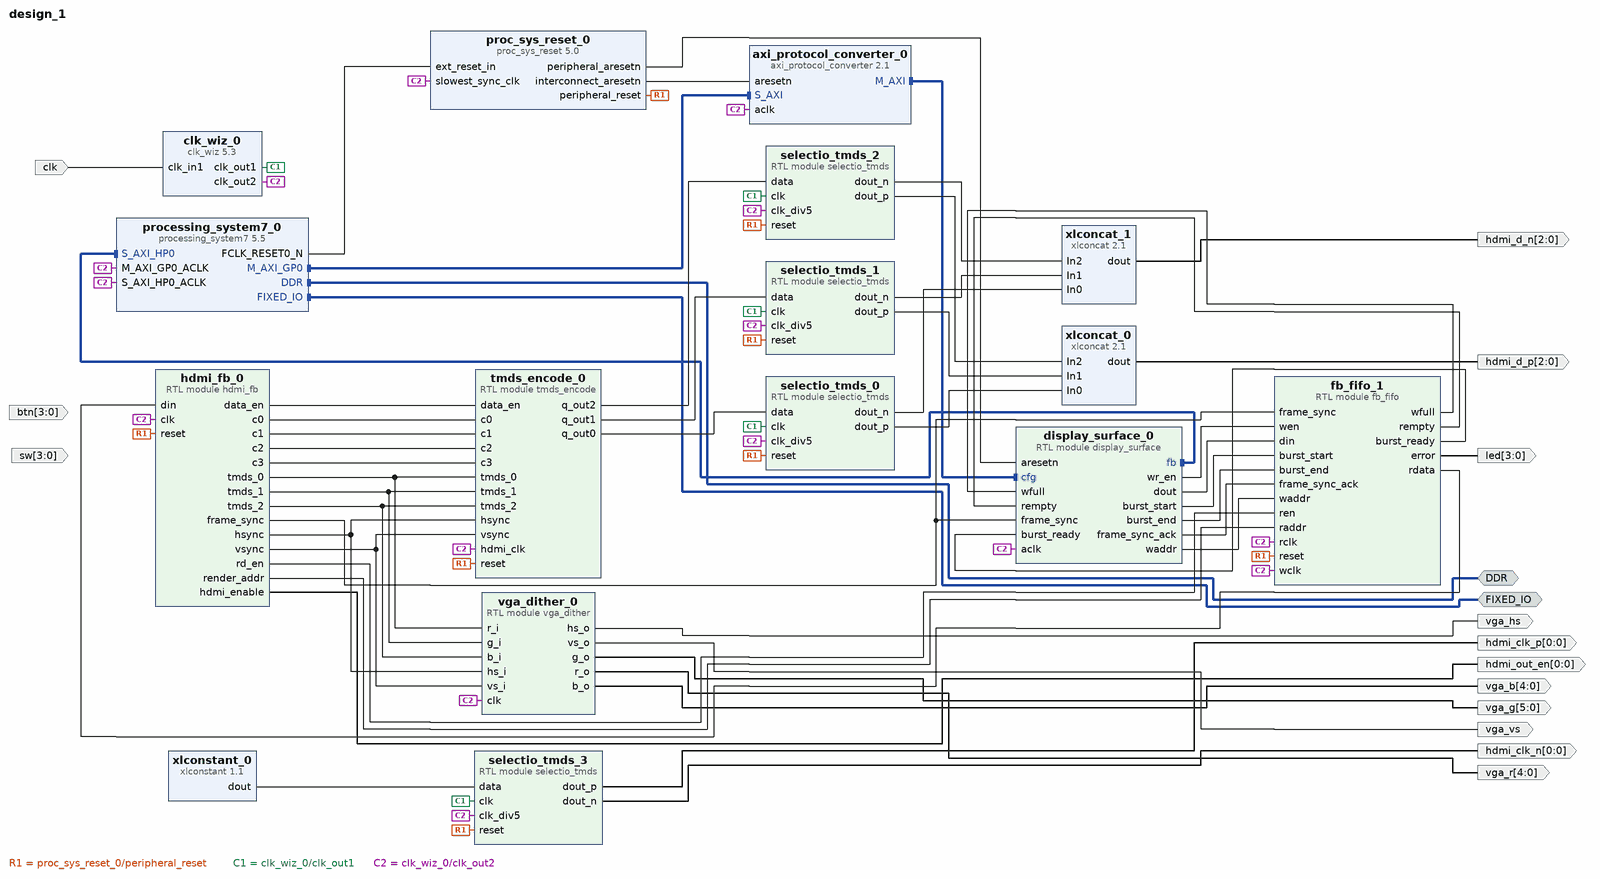
[diagram p0: block diagram of the top level]
# Vivado block design design_1, Vivado 2016.2
create_bd_design design_1

create_bd_intf_port -mode Master -vlnv xilinx.com:interface:ddrx_rtl:1.0 DDR
create_bd_intf_port -mode Master -vlnv xilinx.com:display_processing_system7:fixedio_rtl:1.0 FIXED_IO
create_bd_port -dir I -from 3 -to 0 -type data btn
create_bd_port -dir I -from 3 -to 0 -type data sw
create_bd_port -dir O -from 0 -to 0 -type data hdmi_out_en
create_bd_port -dir O -from 2 -to 0 -type data hdmi_d_p
create_bd_port -dir O -from 2 -to 0 -type data hdmi_d_n
create_bd_port -dir O -from 0 -to 0 -type clk hdmi_clk_p
create_bd_port -dir O -from 0 -to 0 -type clk hdmi_clk_n
create_bd_port -dir O vga_hs
create_bd_port -dir O vga_vs
create_bd_port -dir O -from 4 -to 0 -type data vga_r
create_bd_port -dir O -from 5 -to 0 -type data vga_g
create_bd_port -dir O -from 4 -to 0 -type data vga_b
create_bd_port -dir O -from 3 -to 0 led
create_bd_port -dir I -type clk clk
set_property -dict {CONFIG.FREQ_HZ 125000000} [get_bd_ports clk]

create_bd_cell -type ip -vlnv xilinx.com:ip:processing_system7:5.5 processing_system7_0
set_property -dict [list \
  CONFIG.PCW_UIPARAM_DDR_FREQ_MHZ 525 \
  CONFIG.PCW_CRYSTAL_PERIPHERAL_FREQMHZ 50.000000 \
  CONFIG.PCW_APU_PERIPHERAL_FREQMHZ 650 \
  CONFIG.PCW_SDIO_PERIPHERAL_FREQMHZ 50 \
  CONFIG.PCW_FPGA0_PERIPHERAL_FREQMHZ 100 \
  CONFIG.PCW_USE_S_AXI_HP0 1 \
  CONFIG.PCW_USE_FABRIC_INTERRUPT 1 \
  CONFIG.PCW_IRQ_F2P_INTR 1 \
  CONFIG.PCW_PRESET_BANK1_VOLTAGE {LVCMOS 1.8V} \
  CONFIG.PCW_UIPARAM_DDR_PARTNO {MT41K128M16 JT-125} \
  CONFIG.PCW_QSPI_PERIPHERAL_ENABLE 1 \
  CONFIG.PCW_QSPI_GRP_SINGLE_SS_ENABLE 1 \
  CONFIG.PCW_QSPI_GRP_FBCLK_ENABLE 1 \
  CONFIG.PCW_ENET0_PERIPHERAL_ENABLE 1 \
  CONFIG.PCW_ENET0_ENET0_IO {MIO 16 .. 27} \
  CONFIG.PCW_ENET0_GRP_MDIO_ENABLE 1 \
  CONFIG.PCW_ENET0_RESET_ENABLE 0 \
  CONFIG.PCW_SD0_PERIPHERAL_ENABLE 1 \
  CONFIG.PCW_SD0_GRP_CD_ENABLE 1 \
  CONFIG.PCW_SD0_GRP_CD_IO {MIO 47} \
  CONFIG.PCW_SD0_GRP_WP_ENABLE 1 \
  CONFIG.PCW_UART1_PERIPHERAL_ENABLE 1 \
  CONFIG.PCW_TTC0_PERIPHERAL_ENABLE 1 \
  CONFIG.PCW_USB0_PERIPHERAL_ENABLE 1 \
  CONFIG.PCW_USB0_RESET_ENABLE 1 \
  CONFIG.PCW_USB0_RESET_IO {MIO 46} \
  CONFIG.PCW_GPIO_MIO_GPIO_ENABLE 1 \
] [get_bd_cells processing_system7_0]
# 106 more settings of processing_system7_0 are not shown: defaults, MIO pin electricals, DDR timing, and values the tool derives
create_bd_cell -type ip -vlnv xilinx.com:ip:proc_sys_reset:5.0 proc_sys_reset_0
create_bd_cell -type ip -vlnv xilinx.com:ip:xlconcat:2.1 xlconcat_0
set_property -dict {CONFIG.NUM_PORTS 3} [get_bd_cells xlconcat_0]
create_bd_cell -type ip -vlnv xilinx.com:ip:xlconcat:2.1 xlconcat_1
set_property -dict {CONFIG.NUM_PORTS 3} [get_bd_cells xlconcat_1]
create_bd_cell -type ip -vlnv xilinx.com:ip:xlconstant:1.1 xlconstant_0
set_property -dict {CONFIG.CONST_WIDTH 10 CONFIG.CONST_VAL 992} [get_bd_cells xlconstant_0]
create_bd_cell -type module -reference selectio_tmds selectio_tmds_0
create_bd_cell -type ip -vlnv xilinx.com:ip:axi_protocol_converter:2.1 axi_protocol_converter_0
create_bd_cell -type module -reference tmds_encode tmds_encode_0
create_bd_cell -type module -reference vga_dither vga_dither_0
create_bd_cell -type module -reference display_surface display_surface_0
create_bd_cell -type module -reference fb_fifo fb_fifo_1
create_bd_cell -type ip -vlnv xilinx.com:ip:clk_wiz:5.3 clk_wiz_0
set_property -dict [list \
  CONFIG.CLKOUT2_USED true \
  CONFIG.NUM_OUT_CLKS 2 \
  CONFIG.CLKOUT1_REQUESTED_OUT_FREQ 125 \
  CONFIG.CLKOUT2_REQUESTED_OUT_FREQ 25 \
  CONFIG.USE_LOCKED false \
  CONFIG.USE_RESET false \
  CONFIG.MMCM_DIVCLK_DIVIDE 1 \
  CONFIG.MMCM_CLKOUT0_DIVIDE_F 8.000 \
  CONFIG.MMCM_CLKOUT1_DIVIDE 40 \
  CONFIG.CLKOUT1_JITTER 119.348 \
  CONFIG.CLKOUT2_JITTER 165.419 \
  CONFIG.CLKOUT2_PHASE_ERROR 96.948 \
] [get_bd_cells clk_wiz_0]
create_bd_cell -type module -reference hdmi_fb hdmi_fb_0
create_bd_cell -type module -reference selectio_tmds selectio_tmds_1
create_bd_cell -type module -reference selectio_tmds selectio_tmds_2
create_bd_cell -type module -reference selectio_tmds selectio_tmds_3

# ---- connections ----

connect_bd_intf_net [get_bd_intf_pins display_surface_0/fb] [get_bd_intf_pins processing_system7_0/S_AXI_HP0]
connect_bd_intf_net [get_bd_intf_pins display_surface_0/cfg] [get_bd_intf_pins axi_protocol_converter_0/M_AXI]
connect_bd_intf_net [get_bd_intf_pins axi_protocol_converter_0/S_AXI] [get_bd_intf_pins processing_system7_0/M_AXI_GP0]
connect_bd_intf_net [get_bd_intf_ports DDR] [get_bd_intf_pins processing_system7_0/DDR]
connect_bd_intf_net [get_bd_intf_ports FIXED_IO] [get_bd_intf_pins processing_system7_0/FIXED_IO]
connect_bd_net [get_bd_pins hdmi_fb_0/tmds_0] [get_bd_pins tmds_encode_0/tmds_0] [get_bd_pins vga_dither_0/r_i]
connect_bd_net [get_bd_pins hdmi_fb_0/tmds_1] [get_bd_pins tmds_encode_0/tmds_1] [get_bd_pins vga_dither_0/g_i]
connect_bd_net [get_bd_pins hdmi_fb_0/tmds_2] [get_bd_pins tmds_encode_0/tmds_2] [get_bd_pins vga_dither_0/b_i]
connect_bd_net [get_bd_pins hdmi_fb_0/hsync] [get_bd_pins tmds_encode_0/hsync] [get_bd_pins vga_dither_0/hs_i]
connect_bd_net [get_bd_pins hdmi_fb_0/vsync] [get_bd_pins tmds_encode_0/vsync] [get_bd_pins vga_dither_0/vs_i]
connect_bd_net [get_bd_pins processing_system7_0/FCLK_RESET0_N] [get_bd_pins proc_sys_reset_0/ext_reset_in]
connect_bd_net [get_bd_pins proc_sys_reset_0/peripheral_reset] \
  [get_bd_pins selectio_tmds_0/reset] [get_bd_pins tmds_encode_0/reset] [get_bd_pins fb_fifo_1/reset] \
  [get_bd_pins hdmi_fb_0/reset] [get_bd_pins selectio_tmds_1/reset] [get_bd_pins selectio_tmds_2/reset] \
  [get_bd_pins selectio_tmds_3/reset]
connect_bd_net [get_bd_pins hdmi_fb_0/data_en] [get_bd_pins tmds_encode_0/data_en]
connect_bd_net [get_bd_pins hdmi_fb_0/hdmi_enable] [get_bd_ports hdmi_out_en]
connect_bd_net [get_bd_pins selectio_tmds_0/dout_p] [get_bd_pins xlconcat_0/In0]
connect_bd_net [get_bd_pins selectio_tmds_1/dout_p] [get_bd_pins xlconcat_0/In1]
connect_bd_net [get_bd_pins selectio_tmds_2/dout_p] [get_bd_pins xlconcat_0/In2]
connect_bd_net [get_bd_pins selectio_tmds_2/dout_n] [get_bd_pins xlconcat_1/In2]
connect_bd_net [get_bd_pins selectio_tmds_1/dout_n] [get_bd_pins xlconcat_1/In1]
connect_bd_net [get_bd_pins selectio_tmds_0/dout_n] [get_bd_pins xlconcat_1/In0]
connect_bd_net [get_bd_pins xlconcat_0/dout] [get_bd_ports hdmi_d_p]
connect_bd_net [get_bd_pins xlconcat_1/dout] [get_bd_ports hdmi_d_n]
connect_bd_net [get_bd_pins selectio_tmds_3/dout_p] [get_bd_ports hdmi_clk_p]
connect_bd_net [get_bd_pins selectio_tmds_3/dout_n] [get_bd_ports hdmi_clk_n]
connect_bd_net [get_bd_pins xlconstant_0/dout] [get_bd_pins selectio_tmds_3/data]
connect_bd_net [get_bd_pins tmds_encode_0/q_out0] [get_bd_pins selectio_tmds_0/data]
connect_bd_net [get_bd_pins tmds_encode_0/q_out1] [get_bd_pins selectio_tmds_1/data]
connect_bd_net [get_bd_pins tmds_encode_0/q_out2] [get_bd_pins selectio_tmds_2/data]
connect_bd_net [get_bd_pins hdmi_fb_0/c0] [get_bd_pins tmds_encode_0/c0]
connect_bd_net [get_bd_pins hdmi_fb_0/c1] [get_bd_pins tmds_encode_0/c1]
connect_bd_net [get_bd_pins hdmi_fb_0/c2] [get_bd_pins tmds_encode_0/c2]
connect_bd_net [get_bd_pins hdmi_fb_0/c3] [get_bd_pins tmds_encode_0/c3]
connect_bd_net -net fb_fifo_1_dout [get_bd_pins fb_fifo_1/rdata] [get_bd_pins hdmi_fb_0/din]
connect_bd_net [get_bd_pins hdmi_fb_0/rd_en] [get_bd_pins fb_fifo_1/ren]
connect_bd_net [get_bd_pins display_surface_0/wr_en] [get_bd_pins fb_fifo_1/wen]
connect_bd_net [get_bd_pins display_surface_0/dout] [get_bd_pins fb_fifo_1/din]
connect_bd_net [get_bd_pins fb_fifo_1/wfull] [get_bd_pins display_surface_0/wfull]
connect_bd_net [get_bd_pins fb_fifo_1/rempty] [get_bd_pins display_surface_0/rempty]
connect_bd_net [get_bd_pins hdmi_fb_0/frame_sync] [get_bd_pins display_surface_0/frame_sync] [get_bd_pins fb_fifo_1/frame_sync]
connect_bd_net [get_bd_pins proc_sys_reset_0/peripheral_aresetn] [get_bd_pins display_surface_0/aresetn]
connect_bd_net [get_bd_pins proc_sys_reset_0/interconnect_aresetn] [get_bd_pins axi_protocol_converter_0/aresetn]
connect_bd_net [get_bd_pins vga_dither_0/hs_o] [get_bd_ports vga_hs]
connect_bd_net [get_bd_pins vga_dither_0/vs_o] [get_bd_ports vga_vs]
connect_bd_net [get_bd_pins vga_dither_0/r_o] [get_bd_ports vga_r]
connect_bd_net [get_bd_pins vga_dither_0/g_o] [get_bd_ports vga_g]
connect_bd_net [get_bd_pins vga_dither_0/b_o] [get_bd_ports vga_b]
connect_bd_net [get_bd_pins fb_fifo_1/error] [get_bd_ports led]
connect_bd_net [get_bd_pins fb_fifo_1/burst_ready] [get_bd_pins display_surface_0/burst_ready]
connect_bd_net [get_bd_pins display_surface_0/burst_start] [get_bd_pins fb_fifo_1/burst_start]
connect_bd_net [get_bd_pins display_surface_0/burst_end] [get_bd_pins fb_fifo_1/burst_end]
connect_bd_net [get_bd_pins display_surface_0/frame_sync_ack] [get_bd_pins fb_fifo_1/frame_sync_ack]
connect_bd_net [get_bd_pins hdmi_fb_0/render_addr] [get_bd_pins fb_fifo_1/raddr]
connect_bd_net [get_bd_pins display_surface_0/waddr] [get_bd_pins fb_fifo_1/waddr]
connect_bd_net [get_bd_pins clk_wiz_0/clk_out1] \
  [get_bd_pins selectio_tmds_0/clk] [get_bd_pins selectio_tmds_1/clk] [get_bd_pins selectio_tmds_2/clk] \
  [get_bd_pins selectio_tmds_3/clk]
connect_bd_net -net clk_wiz_1_clk_out2 [get_bd_pins clk_wiz_0/clk_out2] \
  [get_bd_pins proc_sys_reset_0/slowest_sync_clk] [get_bd_pins tmds_encode_0/hdmi_clk] [get_bd_pins selectio_tmds_0/clk_div5] \
  [get_bd_pins vga_dither_0/clk] [get_bd_pins axi_protocol_converter_0/aclk] \
  [get_bd_pins processing_system7_0/S_AXI_HP0_ACLK] [get_bd_pins processing_system7_0/M_AXI_GP0_ACLK] \
  [get_bd_pins display_surface_0/aclk] [get_bd_pins fb_fifo_1/rclk] [get_bd_pins fb_fifo_1/wclk] [get_bd_pins hdmi_fb_0/clk] \
  [get_bd_pins selectio_tmds_1/clk_div5] [get_bd_pins selectio_tmds_2/clk_div5] [get_bd_pins selectio_tmds_3/clk_div5]
connect_bd_net [get_bd_ports clk] [get_bd_pins clk_wiz_0/clk_in1]

# ---- address map ----
assign_bd_address -offset 0x00000000 -range 512M -target_address_space [get_bd_addr_spaces display_surface_0/fb] [get_bd_addr_segs processing_system7_0/S_AXI_HP0/HP0_DDR_LOWOCM]
assign_bd_address -offset 0x40000000 -range 1G -target_address_space [get_bd_addr_spaces processing_system7_0/Data] [get_bd_addr_segs display_surface_0/cfg/reg0]

validate_bd_design
save_bd_design
